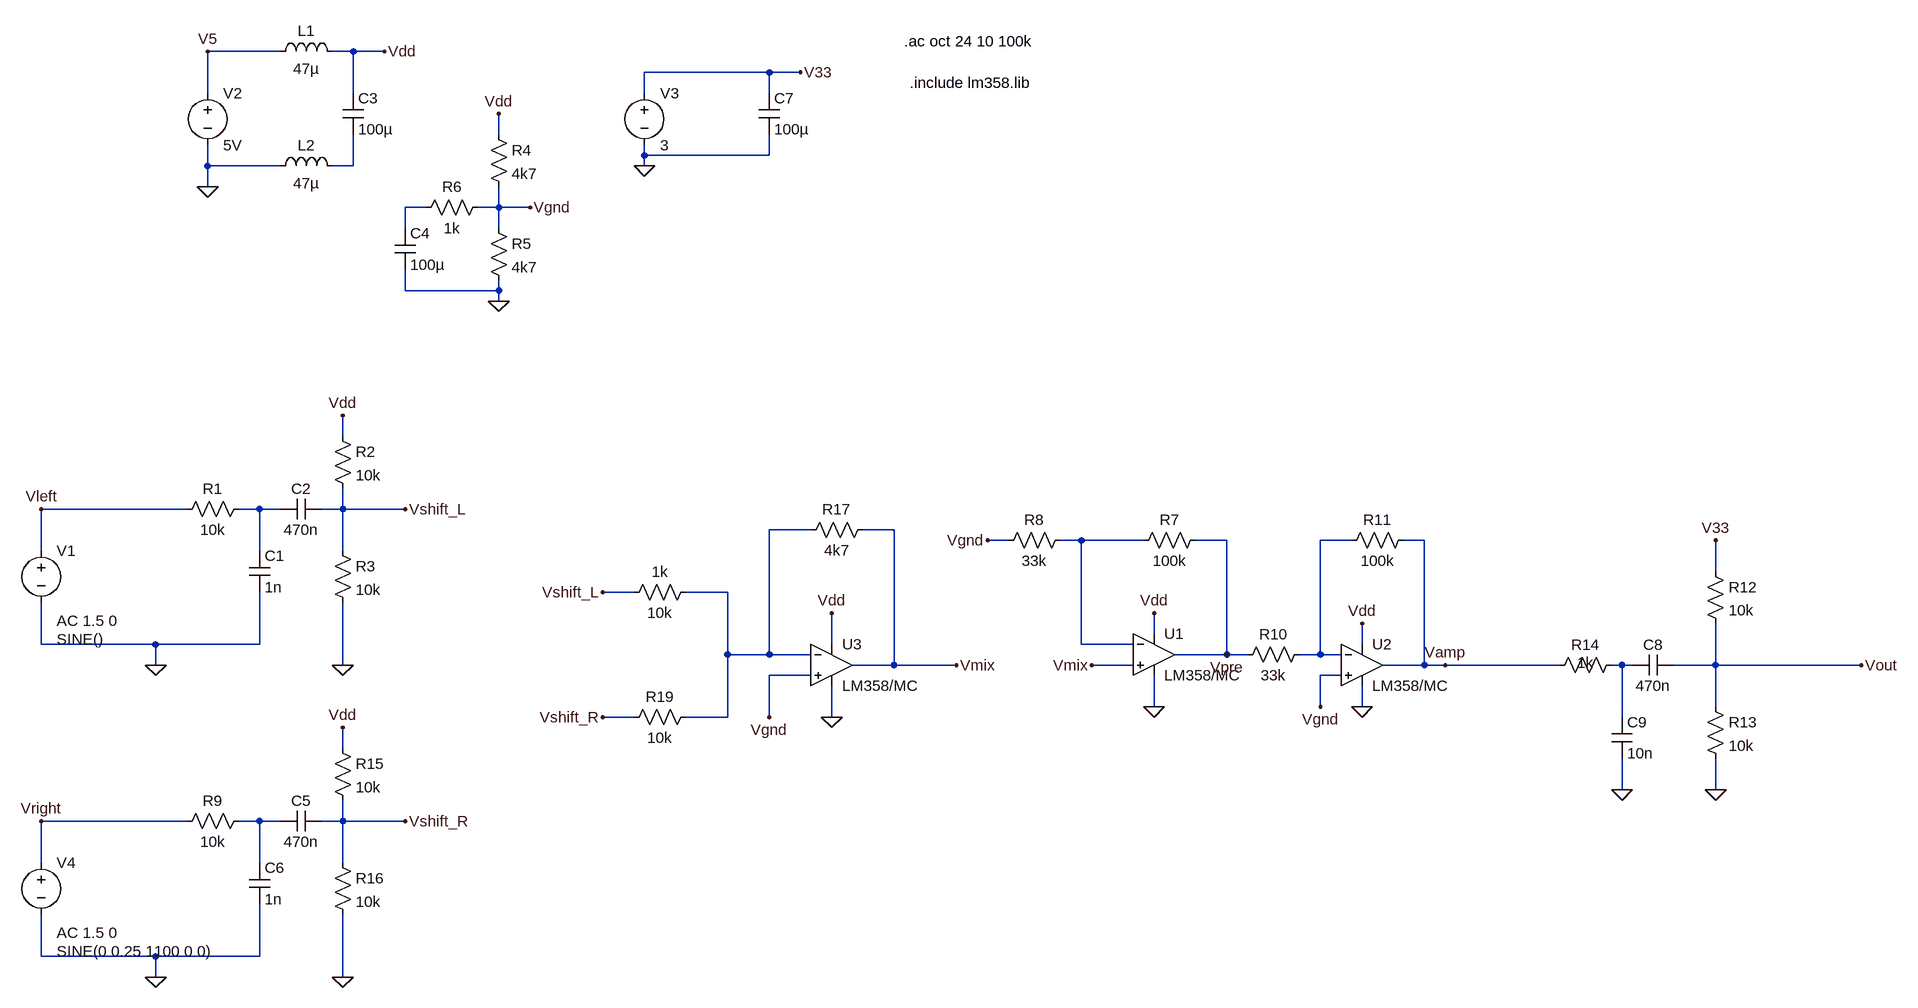
[diagram p0: schematic AuxInAmp.asc]
AuxInAmp.asc, the LTspice schematic file:
Version 4
SHEET 1 1856 820
WIRE -1008 -736 -1120 -736
WIRE -896 -736 -928 -736
WIRE -848 -736 -896 -736
WIRE -256 -704 -448 -704
WIRE -208 -704 -256 -704
WIRE -1120 -672 -1120 -736
WIRE -896 -672 -896 -736
WIRE -448 -672 -448 -704
WIRE -256 -672 -256 -704
WIRE -672 -608 -672 -640
WIRE -448 -576 -448 -592
WIRE -256 -576 -256 -608
WIRE -256 -576 -448 -576
WIRE -1120 -560 -1120 -592
WIRE -1008 -560 -1120 -560
WIRE -896 -560 -896 -608
WIRE -896 -560 -928 -560
WIRE -448 -560 -448 -576
WIRE -1120 -528 -1120 -560
WIRE -784 -496 -816 -496
WIRE -672 -496 -672 -528
WIRE -672 -496 -704 -496
WIRE -624 -496 -672 -496
WIRE -816 -464 -816 -496
WIRE -672 -464 -672 -496
WIRE -816 -368 -816 -400
WIRE -672 -368 -672 -384
WIRE -672 -368 -816 -368
WIRE -672 -352 -672 -368
WIRE -912 -144 -912 -176
WIRE -1152 -32 -1376 -32
WIRE -1040 -32 -1072 -32
WIRE -1008 -32 -1040 -32
WIRE -912 -32 -912 -64
WIRE -912 -32 -944 -32
WIRE -816 -32 -912 -32
WIRE -192 0 -256 0
WIRE -64 0 -112 0
WIRE 112 16 80 16
WIRE 224 16 192 16
WIRE 320 16 224 16
WIRE 448 16 400 16
WIRE 640 16 592 16
WIRE 752 16 720 16
WIRE -1376 32 -1376 -32
WIRE -1040 32 -1040 -32
WIRE -912 32 -912 -32
WIRE 1200 64 1200 16
WIRE -464 96 -512 96
WIRE -320 96 -384 96
WIRE 336 160 336 128
WIRE -1376 176 -1376 112
WIRE -1200 176 -1376 176
WIRE -1040 176 -1040 96
WIRE -1040 176 -1200 176
WIRE -160 176 -160 128
WIRE 224 176 224 16
WIRE 304 176 224 176
WIRE 656 176 656 144
WIRE -320 192 -320 96
WIRE -256 192 -256 0
WIRE -256 192 -320 192
WIRE -192 192 -256 192
WIRE 448 192 448 16
WIRE 448 192 368 192
WIRE 480 192 448 192
WIRE 592 192 592 16
WIRE 592 192 560 192
WIRE 624 192 592 192
WIRE -1200 208 -1200 176
WIRE -912 208 -912 112
WIRE -64 208 -64 0
WIRE -64 208 -128 208
WIRE 32 208 -64 208
WIRE 304 208 240 208
WIRE 752 208 752 16
WIRE 752 208 688 208
WIRE 784 208 752 208
WIRE 960 208 784 208
WIRE 1056 208 1040 208
WIRE 1072 208 1056 208
WIRE 1200 208 1200 144
WIRE 1200 208 1136 208
WIRE 1424 208 1200 208
WIRE -192 224 -256 224
WIRE 624 224 592 224
WIRE 336 272 336 224
WIRE 592 272 592 224
WIRE 656 272 656 240
WIRE 1200 272 1200 208
WIRE -464 288 -512 288
WIRE -320 288 -320 192
WIRE -320 288 -384 288
WIRE -256 288 -256 224
WIRE -160 288 -160 240
WIRE 1056 288 1056 208
WIRE -912 336 -912 304
WIRE 1056 400 1056 352
WIRE 1200 400 1200 352
WIRE -1152 448 -1376 448
WIRE -1040 448 -1072 448
WIRE -1008 448 -1040 448
WIRE -912 448 -912 416
WIRE -912 448 -944 448
WIRE -816 448 -912 448
WIRE -1376 512 -1376 448
WIRE -1040 512 -1040 448
WIRE -912 512 -912 448
WIRE -1376 656 -1376 592
WIRE -1200 656 -1376 656
WIRE -1040 656 -1040 576
WIRE -1040 656 -1200 656
WIRE -1200 688 -1200 656
WIRE -912 688 -912 592
FLAG -912 -176 Vdd
FLAG -912 208 0
FLAG -1120 -528 0
FLAG -848 -736 Vdd
FLAG -1120 -736 V5
FLAG -1376 -32 Vleft
FLAG -1200 208 0
FLAG -672 -352 0
FLAG -672 -640 Vdd
FLAG -624 -496 Vgnd
FLAG 336 272 0
FLAG 336 128 Vdd
FLAG 80 16 Vgnd
FLAG -448 -560 0
FLAG -208 -704 V33
FLAG 592 272 Vgnd
FLAG 656 272 0
FLAG 656 144 Vdd
FLAG 784 208 Vamp
FLAG 1200 400 0
FLAG 1200 16 V33
FLAG 1424 208 Vout
FLAG 1056 400 0
FLAG -816 -32 Vshift_L
FLAG 240 208 Vmix
FLAG -912 304 Vdd
FLAG -912 688 0
FLAG -1376 448 Vright
FLAG -1200 688 0
FLAG -816 448 Vshift_R
FLAG -160 288 0
FLAG -160 128 Vdd
FLAG 32 208 Vmix
FLAG -256 288 Vgnd
FLAG -512 96 Vshift_L
FLAG -512 288 Vshift_R
FLAG 448 192 Vpre
SYMBOL voltage -1376 16 R0
WINDOW 3 24 152 Left 2
WINDOW 123 24 124 Left 2
WINDOW 39 0 0 Left 2
SYMATTR Value SINE()
SYMATTR Value2 AC 1.5 0
SYMATTR InstName V1
SYMBOL res -1056 -48 R90
WINDOW 0 0 56 VBottom 2
WINDOW 3 32 56 VTop 2
SYMATTR InstName R1
SYMATTR Value 10k
SYMBOL cap -944 -48 R90
WINDOW 0 0 32 VBottom 2
WINDOW 3 32 32 VTop 2
SYMATTR InstName C2
SYMATTR Value 470n
SYMBOL res -928 -160 R0
SYMATTR InstName R2
SYMATTR Value 10k
SYMBOL res -928 16 R0
SYMATTR InstName R3
SYMATTR Value 10k
SYMBOL cap -1056 32 R0
SYMATTR InstName C1
SYMATTR Value 1n
SYMBOL voltage -1120 -688 R0
WINDOW 123 0 0 Left 2
WINDOW 39 0 0 Left 2
SYMATTR InstName V2
SYMATTR Value 5V
SYMBOL ind -1024 -720 R270
WINDOW 0 32 56 VTop 2
WINDOW 3 5 56 VBottom 2
SYMATTR InstName L1
SYMATTR Value 47µ
SYMBOL cap -912 -672 R0
SYMATTR InstName C3
SYMATTR Value 100µ
SYMBOL ind -1024 -544 R270
WINDOW 0 32 56 VTop 2
WINDOW 3 5 56 VBottom 2
SYMATTR InstName L2
SYMATTR Value 47µ
SYMBOL res -688 -624 R0
SYMATTR InstName R4
SYMATTR Value 4k7
SYMBOL res -688 -480 R0
SYMATTR InstName R5
SYMATTR Value 4k7
SYMBOL res -688 -512 R90
WINDOW 0 0 56 VBottom 2
WINDOW 3 32 56 VTop 2
SYMATTR InstName R6
SYMATTR Value 1k
SYMBOL cap -832 -464 R0
SYMATTR InstName C4
SYMATTR Value 100µ
SYMBOL Opamps\\opamp2 336 128 R0
SYMATTR InstName U1
SYMATTR Value LM358/MC
SYMATTR SpiceModel LM358/MC
SYMBOL res 416 0 R90
WINDOW 0 0 56 VBottom 2
WINDOW 3 32 56 VTop 2
SYMATTR InstName R7
SYMATTR Value 100k
SYMBOL res 208 0 R90
WINDOW 0 0 56 VBottom 2
WINDOW 3 32 56 VTop 2
SYMATTR InstName R8
SYMATTR Value 33k
SYMBOL voltage -448 -688 R0
WINDOW 123 0 0 Left 2
WINDOW 39 0 0 Left 2
SYMATTR InstName V3
SYMATTR Value 3
SYMBOL cap -272 -672 R0
SYMATTR InstName C7
SYMATTR Value 100µ
SYMBOL Opamps\\opamp2 656 144 R0
SYMATTR InstName U2
SYMATTR Value LM358/MC
SYMATTR Value2 LM358/MC
SYMBOL res 576 176 R90
WINDOW 0 0 56 VBottom 2
WINDOW 3 32 56 VTop 2
SYMATTR InstName R10
SYMATTR Value 33k
SYMBOL res 736 0 R90
WINDOW 0 0 56 VBottom 2
WINDOW 3 32 56 VTop 2
SYMATTR InstName R11
SYMATTR Value 100k
SYMBOL cap 1136 192 R90
WINDOW 0 0 32 VBottom 2
WINDOW 3 32 32 VTop 2
SYMATTR InstName C8
SYMATTR Value 470n
SYMBOL res 1184 48 R0
SYMATTR InstName R12
SYMATTR Value 10k
SYMBOL res 1184 256 R0
SYMATTR InstName R13
SYMATTR Value 10k
SYMBOL res 1056 192 R90
WINDOW 0 0 56 VBottom 2
WINDOW 3 28 56 VBottom 2
SYMATTR InstName R14
SYMATTR Value 1k
SYMBOL cap 1040 288 R0
SYMATTR InstName C9
SYMATTR Value 10n
SYMBOL voltage -1376 496 R0
WINDOW 3 24 152 Left 2
WINDOW 123 24 124 Left 2
WINDOW 39 0 0 Left 2
SYMATTR Value SINE(0 0.25 1100 0 0)
SYMATTR Value2 AC 1.5 0
SYMATTR InstName V4
SYMBOL res -1056 432 R90
WINDOW 0 0 56 VBottom 2
WINDOW 3 32 56 VTop 2
SYMATTR InstName R9
SYMATTR Value 10k
SYMBOL cap -944 432 R90
WINDOW 0 0 32 VBottom 2
WINDOW 3 32 32 VTop 2
SYMATTR InstName C5
SYMATTR Value 470n
SYMBOL res -928 320 R0
SYMATTR InstName R15
SYMATTR Value 10k
SYMBOL res -928 496 R0
SYMATTR InstName R16
SYMATTR Value 10k
SYMBOL cap -1056 512 R0
SYMATTR InstName C6
SYMATTR Value 1n
SYMBOL Opamps\\opamp2 -160 144 R0
SYMATTR InstName U3
SYMATTR Value LM358/MC
SYMATTR SpiceModel LM358/MC
SYMBOL res -96 -16 R90
WINDOW 0 0 56 VBottom 2
WINDOW 3 32 56 VTop 2
SYMATTR InstName R17
SYMATTR Value 4k7
SYMBOL res -368 80 R90
WINDOW 0 0 56 VBottom 2
WINDOW 3 32 56 VTop 2
SYMATTR InstName 1k
SYMATTR Value 10k
SYMBOL res -368 272 R90
WINDOW 0 0 56 VBottom 2
WINDOW 3 32 56 VTop 2
SYMATTR InstName R19
SYMATTR Value 10k
TEXT -48 -752 Left 2 !.ac oct 24 10 100k
TEXT -40 -688 Left 2 !.include lm358.lib

The netlist it stands for:
* AuxInAmp.asc
V1 Vleft 0 SINE() AC 1.5 0
R1 N003 Vleft 10k
C2 Vshift_L N003 470n
R2 Vdd Vshift_L 10k
R3 Vshift_L 0 10k
C1 N003 0 1n
V2 V5 0 5V
L1 V5 Vdd 47µ
C3 Vdd N001 100µ
L2 0 N001 47µ
R4 Vdd Vgnd 4k7
R5 Vgnd 0 4k7
R6 Vgnd N002 1k
C4 N002 0 100µ
XU1 Vmix N005 Vdd 0 Vpre LM358/MC LM358/MC  ; pins In+ In- V+ V- OUT
R7 Vpre N005 100k
R8 N005 Vgnd 33k
V3 V33 0 3
C7 V33 0 100µ
XU2 Vgnd N006 Vdd 0 Vamp LM358/MC LM358/MC  ; pins In+ In- V+ V- OUT
R10 N006 Vpre 33k
R11 Vamp N006 100k
C8 Vout N007 470n
R12 V33 Vout 10k
R13 Vout 0 10k
R14 N007 Vamp 1k
C9 N007 0 10n
V4 Vright 0 SINE(0 0.25 1100 0 0) AC 1.5 0
R9 N008 Vright 10k
C5 Vshift_R N008 470n
R15 Vdd Vshift_R 10k
R16 Vshift_R 0 10k
C6 N008 0 1n
XU3 Vgnd N004 Vdd 0 Vmix LM358/MC LM358/MC  ; pins In+ In- V+ V- OUT
R17 Vmix N004 4k7
R§1k N004 Vshift_L 10k
R19 N004 Vshift_R 10k
.ac oct 24 10 100k
.include lm358.lib
.backanno
.end